# Altium schematic sheet Peripherial.SchDoc
size A4
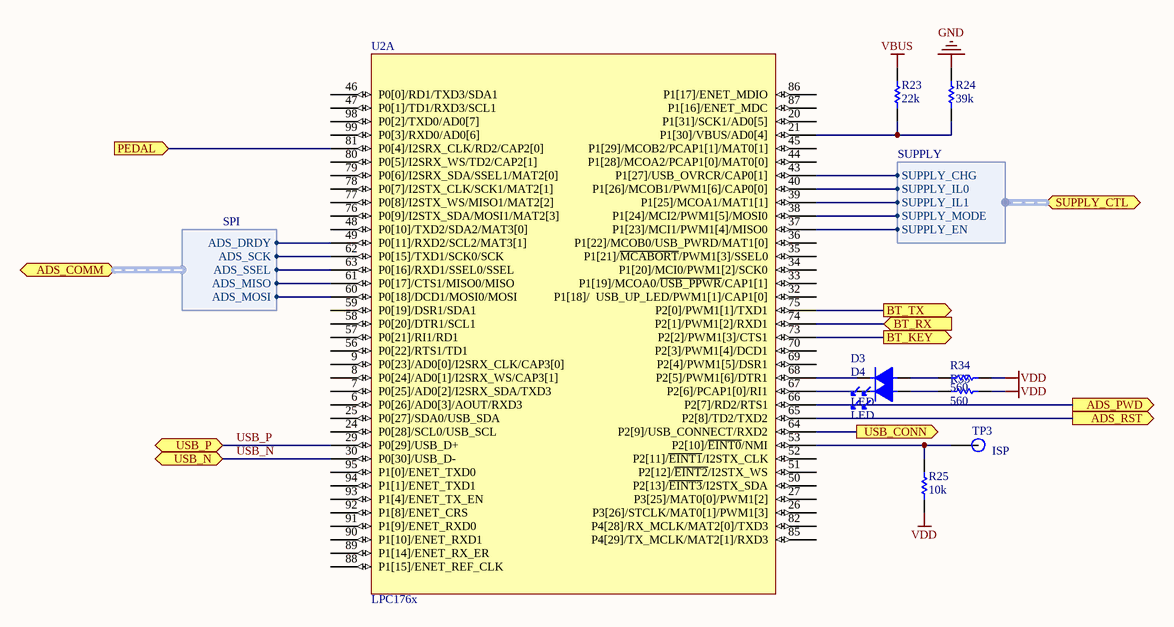
[diagram p0: Peripherial.SchDoc]

## Parts
D3  LED  [LED0805]
D4  LED  [LED0805]
R23  value 22k  [0805]  (hidden comment: Resistor)
R24  value 39k  [0805]  (hidden comment: Resistor)
R25  value 10k  [0805]  (hidden comment: Resistor)
R34  value 560  [0805]  (hidden comment: Resistor)
R35  value 560  [0805]  (hidden comment: Resistor)
TP3  value ISP  [PAD]  (hidden comment: TP)
U2  LPC176x  [QFP100]  (part A of 2)

## Ports
ADS_COMM (harness SPI), ADS_PWD (out), ADS_RST (out), BT_KEY (out), BT_RX (in), BT_TX (out), PEDAL (in), SUPPLY_CTL (harness SUPPLY), USB_CONN (out), USB_N (bidir), USB_P (bidir)

## Harnesses
SPI: ADS_DRDY, ADS_SCK, ADS_SSEL, ADS_MISO, ADS_MOSI
SUPPLY: SUPPLY_CHG, SUPPLY_IL0, SUPPLY_IL1, SUPPLY_MODE, SUPPLY_EN

## Nets
GND: R24.1
VBUS: R23.2
VDD: R25.1 R34.2 R35.2
ADS_PWD: U2.66(P2[7]/RD2/RTS1) ; port ADS_PWD
ADS_RST: U2.65(P2[8]/TD2/TXD2) ; port ADS_RST
BT_KEY: U2.73(P2[2]/PWM1[3]/CTS1) ; port BT_KEY
BT_RX: U2.74(P2[1]/PWM1[2]/RXD1) ; port BT_RX
BT_TX: U2.75(P2[0]/PWM1[1]/TXD1) ; port BT_TX
PEDAL: U2.81(P0[4]/I2SRX_CLK/RD2/CAP2[0]) ; port PEDAL
USB_CONN: U2.64(P2[9]/USB_CONNECT/RXD2) ; port USB_CONN
USB_N: U2.30(P0[30]/USB_D-) ; port USB_N
USB_P: U2.29(P0[29]/USB_D+) ; port USB_P
NetD3_1: D3.1 R34.1
NetD3_2: D3.2 U2.68(P2[5]/PWM1[6]/DTR1)
NetD4_1: D4.1 R35.1
NetD4_2: D4.2 U2.67(P2[6]/PCAP1[0]/RI1)
NetR23_1: R23.1 R24.2 U2.21(P1[30]/VBUS/AD0[4])
NetR25_2: R25.2 TP3.1 U2.53(P2[10]/~{EINT0}/NMI)
NetU2_37: U2.37(P1[23]/MCI1/PWM1[4]/MISO0) ; port SUPPLY_CTL.SUPPLY_EN
NetU2_38: U2.38(P1[24]/MCI2/PWM1[5]/MOSI0) ; port SUPPLY_CTL.SUPPLY_MODE
NetU2_39: U2.39(P1[25]/MCOA1/MAT1[1]) ; port SUPPLY_CTL.SUPPLY_IL1
NetU2_40: U2.40(P1[26]/MCOB1/PWM1[6]/CAP0[0]) ; port SUPPLY_CTL.SUPPLY_IL0
NetU2_43: U2.43(P1[27]/USB_OVRCR/CAP0[1]) ; port SUPPLY_CTL.SUPPLY_CHG
NetU2_49: U2.49(P0[11]/RXD2/SCL2/MAT3[1]) ; port ADS_COMM.ADS_DRDY
NetU2_60: U2.60(P0[18]/DCD1/MOSI0/MOSI) ; port ADS_COMM.ADS_MOSI
NetU2_61: U2.61(P0[17]/CTS1/MISO0/MISO) ; port ADS_COMM.ADS_MISO
NetU2_62: U2.62(P0[15]/TXD1/SCK0/SCK) ; port ADS_COMM.ADS_SCK
NetU2_63: U2.63(P0[16]/RXD1/SSEL0/SSEL) ; port ADS_COMM.ADS_SSEL

Not connected (* = marked no-connect by the designer): U2 6(P0[26]/AD0[3]/AOUT/RXD3) 7(P0[25]/AD0[2]/I2SRX_SDA/TXD3) 8(P0[24]/AD0[1]/I2SRX_WS/CAP3[1]) 9(P0[23]/AD0[0]/I2SRX_CLK/CAP3[0]) 20(P1[31]/SCK1/AD0[5]) 24(P0[28]/SCL0/USB_SCL) 25(P0[27]/SDA0/USB_SDA) 26(P3[26]/STCLK/MAT0[1]/PWM1[3]) 27(P3[25]/MAT0[0]/PWM1[2]) 32(P1[18]/__USB_UP_LED/PWM1[1]/CAP1[0]) 33(P1[19]/MCOA0/~{USB_PPWR}/CAP1[1]) 34(P1[20]/MCI0/PWM1[2]/SCK0) 35(P1[21]/~{MCABORT}/PWM1[3]/SSEL0) 36(P1[22]/MCOB0/USB_PWRD/MAT1[0]) 44(P1[28]/MCOA2/PCAP1[0]/MAT0[0]) 45(P1[29]/MCOB2/PCAP1[1]/MAT0[1]) 46(P0[0]/RD1/TXD3/SDA1) 47(P0[1]/TD1/RXD3/SCL1) 48(P0[10]/TXD2/SDA2/MAT3[0]) 50(P2[13]/~{EINT3}/I2STX_SDA) 51(P2[12]/~{EINT2}/I2STX_WS) 52(P2[11]/~{EINT1}/I2STX_CLK) 56(P0[22]/RTS1/TD1) 57(P0[21]/RI1/RD1) 58(P0[20]/DTR1/SCL1) 59(P0[19]/DSR1/SDA1) 69(P2[4]/PWM1[5]/DSR1) 70(P2[3]/PWM1[4]/DCD1) 76(P0[9]/I2STX_SDA/MOSI1/MAT2[3]) 77(P0[8]/I2STX_WS/MISO1/MAT2[2]) 78(P0[7]/I2STX_CLK/SCK1/MAT2[1]) 79(P0[6]/I2SRX_SDA/SSEL1/MAT2[0]) 80(P0[5]/I2SRX_WS/TD2/CAP2[1]) 82(P4[28]/RX_MCLK/MAT2[0]/TXD3) 85(P4[29]/TX_MCLK/MAT2[1]/RXD3) 86(P1[17]/ENET_MDIO) 87(P1[16]/ENET_MDC) 88(P1[15]/ENET_REF_CLK) 89(P1[14]/ENET_RX_ER) 90(P1[10]/ENET_RXD1) 91(P1[9]/ENET_RXD0) 92(P1[8]/ENET_CRS) 93(P1[4]/ENET_TX_EN) 94(P1[1]/ENET_TXD1) 95(P1[0]/ENET_TXD0) 98(P0[2]/TXD0/AD0[7]) 99(P0[3]/RXD0/AD0[6])

## Library data of the parts
TP3 = Test Point
U2 = LPC_17x: LPC176x Microcontroller